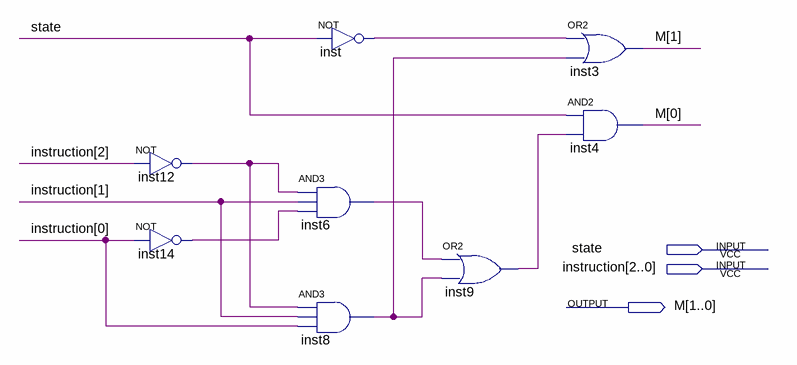
[diagram p0: schematic sheet]
// Quartus schematic controler_M_enable.bdf as structural Verilog: 8 symbols, 3 pins
module controler_M_enable (
  input  state,
  input  [2:0] instruction,
  output [1:0] M
);

  wire inst6_out, inst8_out, inst9_out, inst12_out, inst14_out, inst_out;

  not inst12 (inst12_out, instruction[2]);
  not inst14 (inst14_out, instruction[0]);
  not inst (inst_out, state);
  and inst6 (inst6_out, inst12_out, instruction[1], inst14_out);
  and inst8 (inst8_out, inst12_out, instruction[1], instruction[0]);
  or inst9 (inst9_out, inst6_out, inst8_out);
  or inst3 (M[1], inst_out, inst8_out);
  and inst4 (M[0], state, inst9_out);
endmodule
